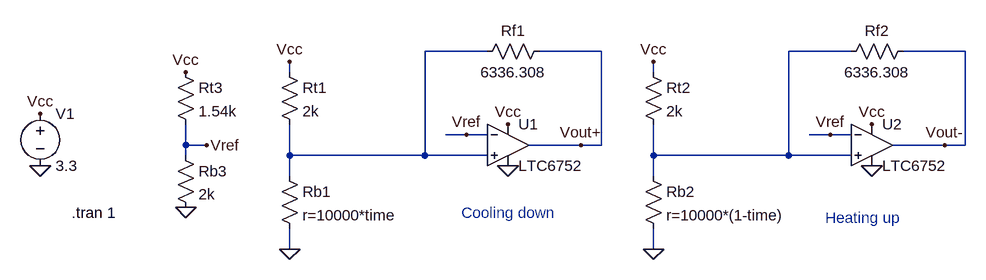
[diagram p0: schematic Thermistor Schmitt Trigger.asc]
Thermistor Schmitt Trigger.asc, the LTspice schematic file:
Version 4
SHEET 1 1200 680
WIRE 256 -336 160 -336
WIRE 432 -336 336 -336
WIRE 816 -336 720 -336
WIRE 992 -336 896 -336
WIRE -48 -304 -48 -320
WIRE 512 -304 512 -320
WIRE 224 -208 192 -208
WIRE 256 -208 224 -208
WIRE 784 -208 752 -208
WIRE 816 -208 784 -208
WIRE -208 -192 -208 -224
WIRE -176 -192 -208 -192
WIRE 400 -192 320 -192
WIRE 432 -192 432 -336
WIRE 432 -192 400 -192
WIRE 960 -192 880 -192
WIRE 992 -192 992 -336
WIRE 992 -192 960 -192
WIRE -208 -176 -208 -192
WIRE -48 -176 -48 -224
WIRE 160 -176 160 -336
WIRE 160 -176 -48 -176
WIRE 256 -176 160 -176
WIRE 512 -176 512 -224
WIRE 720 -176 720 -336
WIRE 720 -176 512 -176
WIRE 816 -176 720 -176
WIRE -48 -144 -48 -176
WIRE 512 -144 512 -176
WIRE -48 -32 -48 -64
WIRE 512 -32 512 -64
FLAG -48 -32 0
FLAG 400 -192 Vout+
FLAG 224 -208 Vref
FLAG -432 -240 Vcc
FLAG -48 -320 Vcc
FLAG -432 -160 0
FLAG 288 -160 0
FLAG 288 -224 Vcc
FLAG 512 -32 0
FLAG 960 -192 Vout-
FLAG 784 -208 Vref
FLAG 512 -320 Vcc
FLAG 848 -160 0
FLAG 848 -224 Vcc
FLAG -208 -96 0
FLAG -208 -304 Vcc
FLAG -176 -192 Vref
SYMBOL voltage -432 -256 R0
WINDOW 123 0 0 Left 2
WINDOW 39 0 0 Left 2
SYMATTR InstName V1
SYMATTR Value 3.3
SYMBOL res -64 -160 R0
SYMATTR InstName Rb1
SYMATTR Value r=10000*time
SYMBOL res -64 -320 R0
SYMATTR InstName Rt1
SYMATTR Value 2k
SYMBOL res 352 -352 R90
WINDOW 0 0 56 VBottom 2
WINDOW 3 32 56 VTop 2
SYMATTR InstName Rf1
SYMATTR Value 6336.308
SYMBOL res 496 -160 R0
SYMATTR InstName Rb2
SYMATTR Value r=10000*(1-time)
SYMBOL res 496 -320 R0
SYMATTR InstName Rt2
SYMATTR Value 2k
SYMBOL res 912 -352 R90
WINDOW 0 0 56 VBottom 2
WINDOW 3 32 56 VTop 2
SYMATTR InstName Rf2
SYMATTR Value 6336.308
SYMBOL Comparators\\LTC6752 288 -256 R0
SYMATTR InstName U1
SYMBOL Comparators\\LTC6752 848 -256 R0
SYMATTR InstName U2
SYMBOL res -224 -320 R0
SYMATTR InstName Rt3
SYMATTR Value 1.54k
SYMBOL res -224 -192 R0
SYMATTR InstName Rb3
SYMATTR Value 2k
TEXT -384 -88 Left 2 !.tran 1
TEXT 216 -88 Left 2 ;Cooling down
TEXT 776 -80 Left 2 ;Heating up

The netlist it stands for:
* Thermistor Schmitt Trigger.asc
V1 Vcc 0 3.3
Rb1 N001 0 r=10000*time
Rt1 Vcc N001 2k
Rf1 Vout+ N001 6336.308
Rb2 N002 0 r=10000*(1-time)
Rt2 Vcc N002 2k
Rf2 Vout- N002 6336.308
XU1 N001 Vref Vcc 0 Vout+ LTC6752  ; pins In+ In- V+ V- OUT
XU2 N002 Vref Vcc 0 Vout- LTC6752  ; pins In+ In- V+ V- OUT
Rt3 Vcc Vref 1.54k
Rb3 Vref 0 2k
.tran 1
* Cooling down
* Heating up
.lib LTC7.lib
.backanno
.end

* Results of the author's LTspice run, read from the files saved beside the schematic
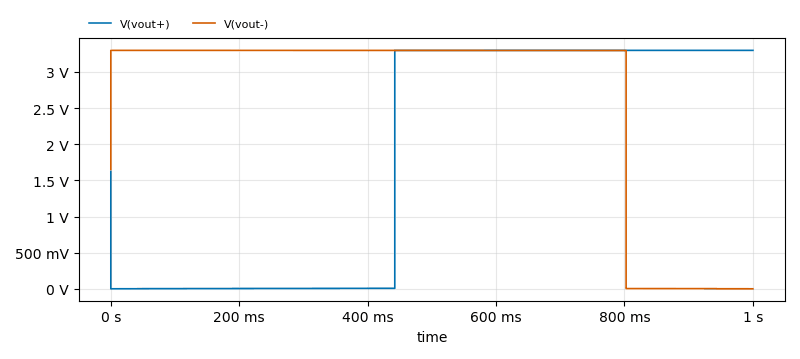
[diagram p1: Transient Analysis of Thermistor Schmitt Trigger.asc, plotted from the saved traces]
* Transient Analysis, 1 run:
*   V(vout+): min 0 V, max 3.299 V, average 1.842 V, rms 2.464 V, last 3.299 V
*   V(vout-): min -4.449 µV, max 3.299 V, average 2.648 V, rms 2.955 V, last -4.449 µV